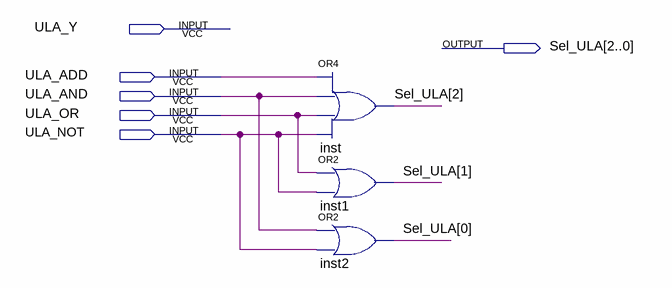
[diagram p0: schematic sheet]
// Quartus schematic encoder_ULA.bdf as structural Verilog: 3 symbols, 6 pins
module encoder_ULA (
  input  ULA_Y,
  input  ULA_ADD,
  input  ULA_AND,
  input  ULA_OR,
  input  ULA_NOT,
  output [2:0] Sel_ULA
);

  or inst (Sel_ULA[2], ULA_ADD, ULA_AND, ULA_OR, ULA_NOT);
  or inst1 (Sel_ULA[1], ULA_OR, ULA_NOT);
  or inst2 (Sel_ULA[0], ULA_AND, ULA_NOT);
endmodule
